# Altium project Arduino_SLVN.PrjPcb
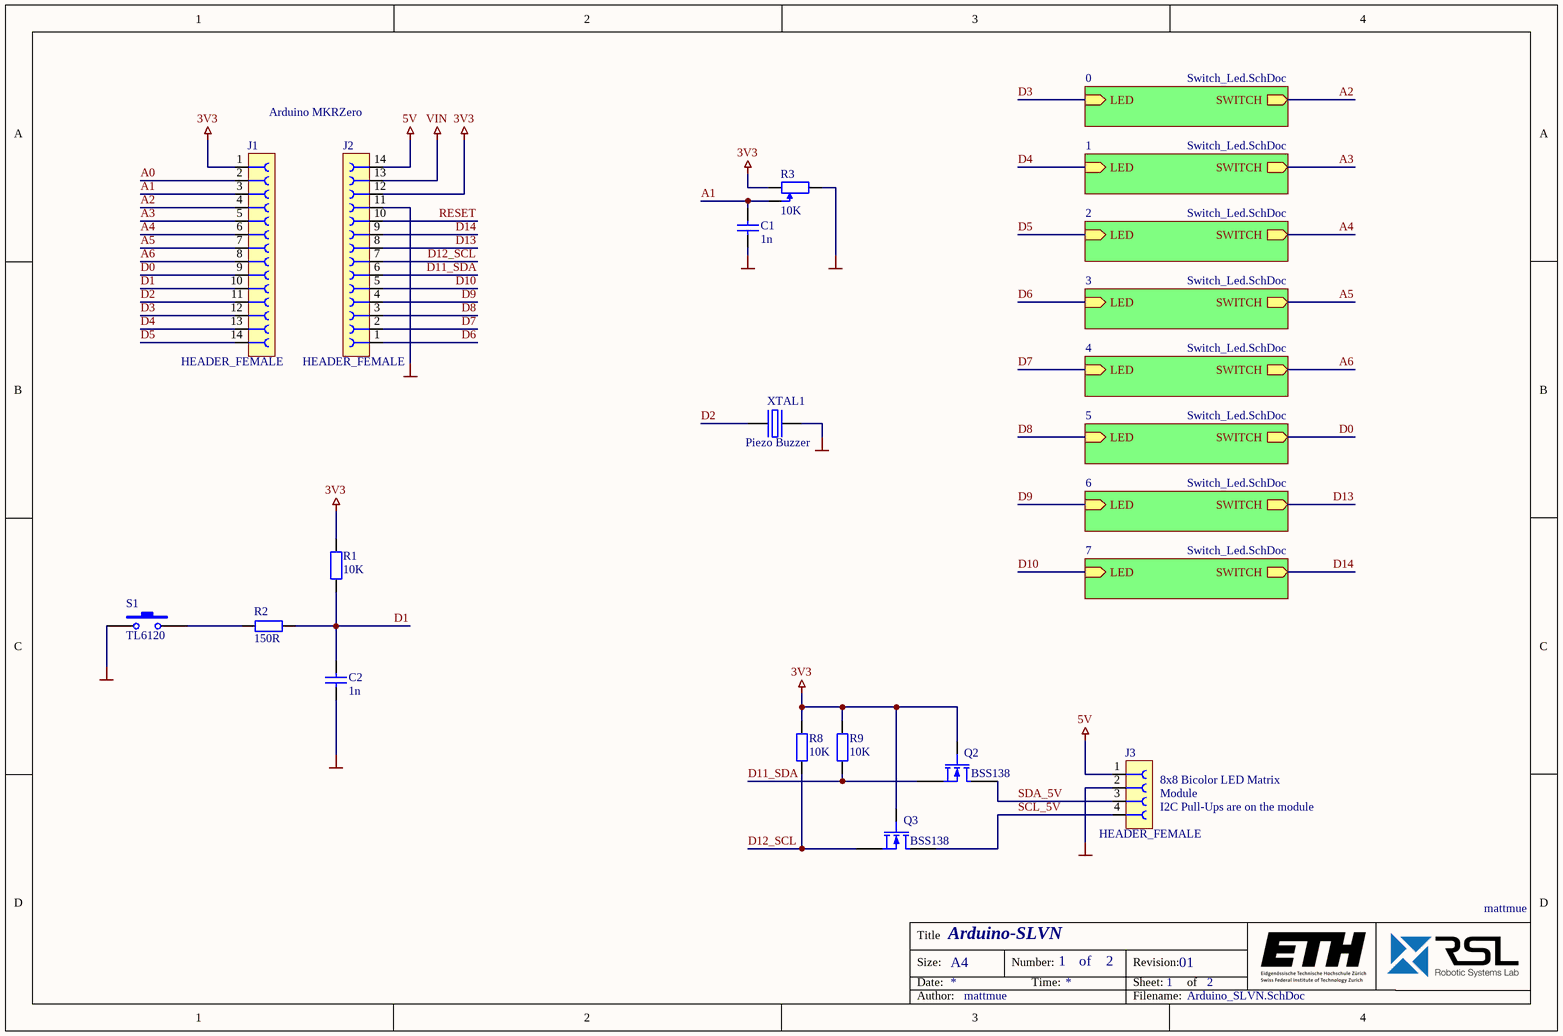
[diagram p0: Arduino_SLVN.SchDoc]
2 sheets, 79 parts. Net scope: hierarchical (ports join the sheet entries above them; power ports are global).
Board file: Arduino_SLVN.PcbDoc
Sheets:
  Arduino_SLVN.SchDoc
    0 = Switch_Led.SchDoc
    1 = Switch_Led.SchDoc
    2 = Switch_Led.SchDoc
    3 = Switch_Led.SchDoc
    4 = Switch_Led.SchDoc
    5 = Switch_Led.SchDoc
    6 = Switch_Led.SchDoc
    7 = Switch_Led.SchDoc

## Sheet Arduino_SLVN.SchDoc: Arduino-SLVN
size A4; Date: no entry; ApprovedBy: no entry; CheckedBy: no entry; Author: mattmue; CompanyName: ETH Zürich; DrawnBy: no entry; Engineer: no entry; Organization: ETH Zürich; Address1: Robotic Systems Lab; Address2: Leonhardstrasse 21; Address3: 8092 Zürich; Address4: Swizerland; DocumentNumber: no entry; Revision: 01; SheetNumber: 1; SheetTotal: 2; Time: no entry; ImagePath: no entry; Application_BuildNumber: no entry

### Parts
C1  value 1n  [SMD_CAPC1608X08N]  (hidden comment: C0603)
C2  value 1n  [SMD_CAPC1608X08N]  (hidden comment: C0603)
J1  HEADER_FEMALE  [THT_CONN_1x14_FEMALE_2.54]
J2  HEADER_FEMALE  [THT_CONN_1x14_FEMALE_2.54]
J3  HEADER_FEMALE  [THT_CONN_1x4_FEMALE_2.54]
Q2  BSS138  [SOT323 SC70]
Q3  BSS138  [SOT323 SC70]
R1  value 10K  [SMD_RESC1608X05N]  (hidden comment: R0603)
R2  value 150R  [SMD_RESC1608X05N]  (hidden comment: R0603)
R3  value 10K  [THT_PTV09A-1]  (hidden comment: PTV09A-4020S-B103)
R8  value 10K  [SMD_RESC1608X05N]  (hidden comment: R0603)
R9  value 10K  [SMD_RESC1608X05N]  (hidden comment: R0603)
S1  TL6120  [SMD_TL6120]
sdfg1  Mattmue-Logo  [GRAPH_MATTMUE_6MM]  (value not drawn)  (no BOM)
XTAL1  Note: Piezo Buzzer  [THT_PIEZO_5mm]  (hidden comment: PS1240P02BT)

### Sub-sheets
0 = Switch_Led.SchDoc: LED (in), SWITCH (out)
1 = Switch_Led.SchDoc: LED (in), SWITCH (out)
2 = Switch_Led.SchDoc: LED (in), SWITCH (out)
3 = Switch_Led.SchDoc: LED (in), SWITCH (out)
4 = Switch_Led.SchDoc: LED (in), SWITCH (out)
5 = Switch_Led.SchDoc: LED (in), SWITCH (out)
6 = Switch_Led.SchDoc: LED (in), SWITCH (out)
7 = Switch_Led.SchDoc: LED (in), SWITCH (out)

### Nets
3V3: J1.1 J2.12 Q2.1(G) Q3.1(G) R1.2 R3.1 R8.2 R9.2
5V: J2.14 J3.1
GND: C1.1 C2.1 J2.11 J3.2 R3.2 S1.1 XTAL1.2
VIN: J2.13
A0: J1.2
A1: C1.2 J1.3 R3.3(TAP)
A2: J1.4 ; sheet 0/SWITCH
A3: J1.5 ; sheet 1/SWITCH
A4: J1.6 ; sheet 2/SWITCH
A5: J1.7 ; sheet 3/SWITCH
A6: J1.8 ; sheet 4/SWITCH
D0: J1.9 ; sheet 5/SWITCH
D1: C2.2 J1.10 R1.1 R2.1
D2: J1.11 XTAL1.1
D3: J1.12 ; sheet 0/LED
D4: J1.13 ; sheet 1/LED
D5: J1.14 ; sheet 2/LED
D6: J2.1 ; sheet 3/LED
D7: J2.2 ; sheet 4/LED
D8: J2.3 ; sheet 5/LED
D9: J2.4 ; sheet 6/LED
D10: J2.5 ; sheet 7/LED
D11_SDA: J2.6 Q2.2(S) R9.1
D12_SCL: J2.7 Q3.2(S) R8.1
D13: J2.8 ; sheet 6/SWITCH
D14: J2.9 ; sheet 7/SWITCH
RESET: J2.10
SCL_5V: J3.4 Q3.3(D)
SDA_5V: J3.3 Q2.3(D)
NetR2_2: R2.2 S1.2

### Notes on the sheet
- Arduino MKRZero
- (near J3) 8x8 Bicolor LED Matrix
- (near J3) I2C Pull-Ups are on the module
- (near J3) Module
- Title
- Size:
- Date:
- A4
- Number:
- Time:
- of
- Revision:
- Sheet:
- Author:
- Filename:
- (in symbol CMPL-001-0415-A.3) mattmue

### Library data of the parts
C1 C2 = CMP-02314-1: CERCAP 1n 100V 1% NP0/C0G 0603; Manufacturer: KEMET; Manufacturer Part Number: C0603C102F1GAC7867; Supplier: Digi-Key; Supplier Part Number: 399-17967-1-ND
J1 J2 = CMP-02128-2: CONN Female 1x14 2.54mm Straight THT 2.54x35.6mm; Manufacturer: Sullins Connector Solutions; Manufacturer Part Number: PPTC141LFBN-RC; Supplier Part Number: S7012-ND; Supplier: Digi-Key
J3 = CMP-02129-1: CONN Female 1x4 2.54mm Straight THT 2.54x10.16mm; Manufacturer: Sullins Connector Solutions; Manufacturer Part Number: PPTC041LFBN-RC; Supplier Part Number: S7002-ND; Supplier: Digi-Key
Q2 Q3 = CMP-01592-1: MOSFET N 0.2A 50V SOT323; Manufacturer2 Part Number: BSS138W-TP; Manufacturer: Diodes Incorporated; Manufacturer Part Number: BSS138W-7-F; Manufacturer2: Micro Commercial Co; Supplier2 Part Number: BSS138W-TPMSCT-ND; Supplier2: Digi-Key; Supplier Part Number: BSS138W-FDICT-ND; Supplier: Digi-Key
R1 R8 R9 = CMPL-001-0158-A.2: RES 10K 100mW 1% 0603; Manufacturer: YAEGO; Manufacturer Part Number: RC0603FR-0710KL; Manufacturer2 Part Number: CRCW060310K0FKEA; Manufacturer2: Vishay Dale; Supplier: Digi-Key; Supplier Part Number: 311-10.0KHRCT-ND; Supplier2: Digi-Key; Supplier2 Part Number: 541-10.0KHCT-ND
R2 = CMPL-001-0114-A.2: RES 150R 100mW 1% 0603; Manufacturer: YAEGO; Manufacturer Part Number: RC0603FR-07150RL; Manufacturer2 Part Number: CRCW0603150RFKEA; Manufacturer2: Vishay Dale; Supplier: Digi-Key; Supplier Part Number: 311-150HRCT-ND; Supplier2: Digi-Key; Supplier2 Part Number: 541-150HCT-ND
R3 = CMPL-001-0007-A.2: POTENTIOMETER 10K 50mW 20% 11x9.7mm; Manufacturer: Bourns Inc.; Note: Straight; Supplier: Digi-Key; Supplier Part Number: PTV09A-4020S-B103-ND; Manufacturer Part Number: PTV09A-4020S-B103
S1 = CMP-01596-1: BUTTON SPST 12V 0.05A 7.4x7.4mm; Manufacturer: E-Switch; Manufacturer Part Number: TL6120CF300QG; Supplier: Digi-Key; Supplier Part Number: EG4355CT-ND
sdfg1 = CMPL-001-0415-A.3: GRAPH MATTMUE
XTAL1 = CMPL-001-0432-2: PASSIVE PIEZO_BUZZER 12.6x7.8mm; Manufacturer: TDK Corporation; Supplier2 Part Number: 160; Supplier Part Number: 445-2525-1-ND; Manufacturer Part Number: PS1240P02BT; Supplier: Digi-Key; Supplier2: Adafruit

## Sheet Switch_Led.SchDoc: Arduino-SLVN
size A4; Date: no entry; ApprovedBy: no entry; CheckedBy: no entry; Author: mattmue; CompanyName: ETH Zürich; DrawnBy: no entry; Engineer: no entry; Organization: ETH Zürich; Address1: Robotic Systems Lab; Address2: Leonhardstrasse 21; Address3: 8092 Zürich; Address4: Swizerland; DocumentNumber: no entry; Revision: 01; SheetNumber: 2; SheetTotal: 2; Time: no entry; ImagePath: no entry; Application_BuildNumber: no entry
Used 8 times, as channels 0, 1, 2, 3, 4, 5, 6, 7. Parts and nets are listed once, with the designators drawn on the sheet.
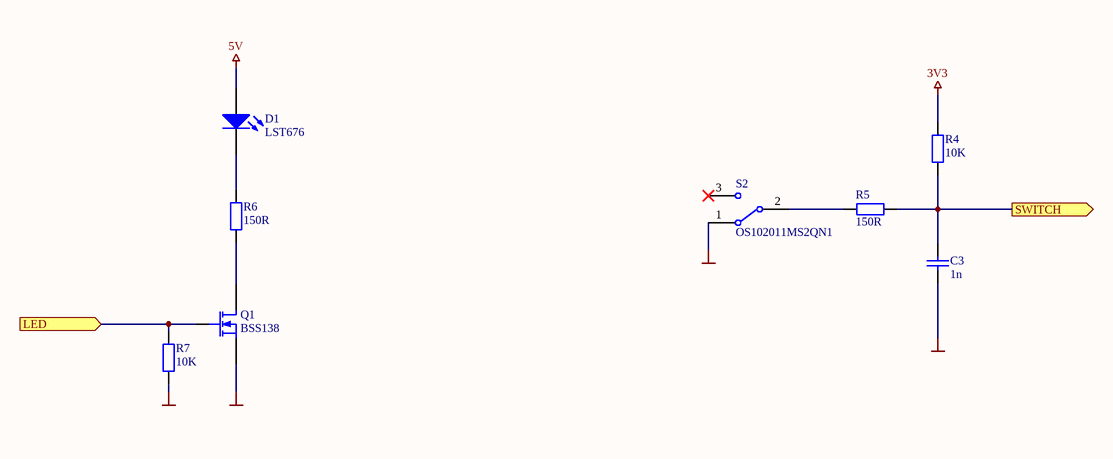
[diagram p1: Switch_Led.SchDoc]

### Parts
C3  value 1n  [SMD_CAPC1608X08N]  (hidden comment: C0603)
D1  LST676  [2-PLCC]
Q1  BSS138  [SOT323 SC70]
R4  value 10K  [SMD_RESC1608X05N]  (hidden comment: R0603)
R5  value 150R  [SMD_RESC1608X05N]  (hidden comment: R0603)
R6  value 150R  [SMD_RESC1608X05N]  (hidden comment: R0603)
R7  value 10K  [SMD_RESC1608X05N]  (hidden comment: R0603)
S2  OS102011MS2QN1  [THT_SLIDESWITCH_86X43]

### Ports
LED (in), SWITCH (out)

### Nets
3V3: R4.2
5V: D1.1(A)
GND: C3.1 Q1.2(S) R7.1 S2.1
LED: Q1.1(G) R7.2 ; port LED
SWITCH: C3.2 R4.1 R5.1 ; port SWITCH
NetD1_2: D1.2(K) R6.2
NetQ1_3: Q1.3(D) R6.1
NetR5_2: R5.2 S2.2

Not connected (* = marked no-connect by the designer): S2 3*

### Channels
0: designators end in _0; ports LED=D3 SWITCH=A2
1: designators end in _1; ports LED=D4 SWITCH=A3
2: designators end in _2; ports LED=D5 SWITCH=A4
3: designators end in _3; ports LED=D6 SWITCH=A5
4: designators end in _4; ports LED=D7 SWITCH=A6
5: designators end in _5; ports LED=D8 SWITCH=D0
6: designators end in _6; ports LED=D9 SWITCH=D13
7: designators end in _7; ports LED=D10 SWITCH=D14

### Notes on the sheet
- Title
- Size:
- Date:
- A4
- Number:
- Time:
- of
- Revision:
- Sheet:
- Author:
- Filename:

### Library data of the parts
C3 = CMP-02314-1: as C1 on sheet Arduino_SLVN; Supplier: Digi-Key; Supplier Part Number: 399-17967-1-ND
D1 = CMP-01594-1: LED RED 30mA 2V 3x3.4mm; Manufacturer: OSRAM Opto Semiconductors Inc.; Manufacturer Part Number: LS T676-R1S1-1-Z; Supplier: Digi-Key; Supplier Part Number: 475-2683-1-ND
Q1 = CMP-01592-1: as Q2 on sheet Arduino_SLVN; Manufacturer2: Micro Commercial Co; Supplier2 Part Number: BSS138W-TPMSCT-ND; Supplier2: Digi-Key; Supplier Part Number: BSS138W-FDICT-ND; Supplier: Digi-Key
R4 R7 = CMPL-001-0158-A.2: as R1 on sheet Arduino_SLVN; Manufacturer2: Vishay Dale; Supplier: Digi-Key; Supplier Part Number: 311-10.0KHRCT-ND; Supplier2: Digi-Key; Supplier2 Part Number: 541-10.0KHCT-ND
R5 R6 = CMPL-001-0114-A.2: as R2 on sheet Arduino_SLVN; Manufacturer2: Vishay Dale; Supplier: Digi-Key; Supplier Part Number: 311-150HRCT-ND; Supplier2: Digi-Key; Supplier2 Part Number: 541-150HCT-ND
S2 = CMPL-001-0005-2: SWITCH SPDT 12V 0.1A 4.3x8.6mm; Manufacturer: C&K; Manufacturer Part Number: OS102011MS2QN1; Supplier: Digi-Key; Supplier Part Number: CKN9565-ND

## Nets that join several sheets
3V3: Arduino_SLVN (8 pins), 0 (R4_0.2), 1 (R4_1.2), 2 (R4_2.2), 3 (R4_3.2), 4 (R4_4.2), 5 (R4_5.2), 6 (R4_6.2), 7 (R4_7.2)
5V: Arduino_SLVN (J2.14 J3.1), 0 (D1_0.1), 1 (D1_1.1), 2 (D1_2.1), 3 (D1_3.1), 4 (D1_4.1), 5 (D1_5.1), 6 (D1_6.1), 7 (D1_7.1)
GND: Arduino_SLVN (7 pins), 0 (C3_0.1 Q1_0.2 R7_0.1 S2_0.1), 1 (C3_1.1 Q1_1.2 R7_1.1 S2_1.1), 2 (C3_2.1 Q1_2.2 R7_2.1 S2_2.1), 3 (C3_3.1 Q1_3.2 R7_3.1 S2_3.1), 4 (C3_4.1 Q1_4.2 R7_4.1 S2_4.1), 5 (C3_5.1 Q1_5.2 R7_5.1 S2_5.1), 6 (C3_6.1 Q1_6.2 R7_6.1 S2_6.1), 7 (C3_7.1 Q1_7.2 R7_7.1 S2_7.1)
A2: Arduino_SLVN (J1.4), 0 (C3_0.2 R4_0.1 R5_0.1)
A3: Arduino_SLVN (J1.5), 1 (C3_1.2 R4_1.1 R5_1.1)
A4: Arduino_SLVN (J1.6), 2 (C3_2.2 R4_2.1 R5_2.1)
A5: Arduino_SLVN (J1.7), 3 (C3_3.2 R4_3.1 R5_3.1)
A6: Arduino_SLVN (J1.8), 4 (C3_4.2 R4_4.1 R5_4.1)
D0: Arduino_SLVN (J1.9), 5 (C3_5.2 R4_5.1 R5_5.1)
D3: Arduino_SLVN (J1.12), 0 (Q1_0.1 R7_0.2)
D4: Arduino_SLVN (J1.13), 1 (Q1_1.1 R7_1.2)
D5: Arduino_SLVN (J1.14), 2 (Q1_2.1 R7_2.2)
D6: Arduino_SLVN (J2.1), 3 (Q1_3.1 R7_3.2)
D7: Arduino_SLVN (J2.2), 4 (Q1_4.1 R7_4.2)
D8: Arduino_SLVN (J2.3), 5 (Q1_5.1 R7_5.2)
D9: Arduino_SLVN (J2.4), 6 (Q1_6.1 R7_6.2)
D10: Arduino_SLVN (J2.5), 7 (Q1_7.1 R7_7.2)
D13: Arduino_SLVN (J2.8), 6 (C3_6.2 R4_6.1 R5_6.1)
D14: Arduino_SLVN (J2.9), 7 (C3_7.2 R4_7.1 R5_7.1)